# EAGLE design PowerReplayUSBC (EAGLE 9.6.2)
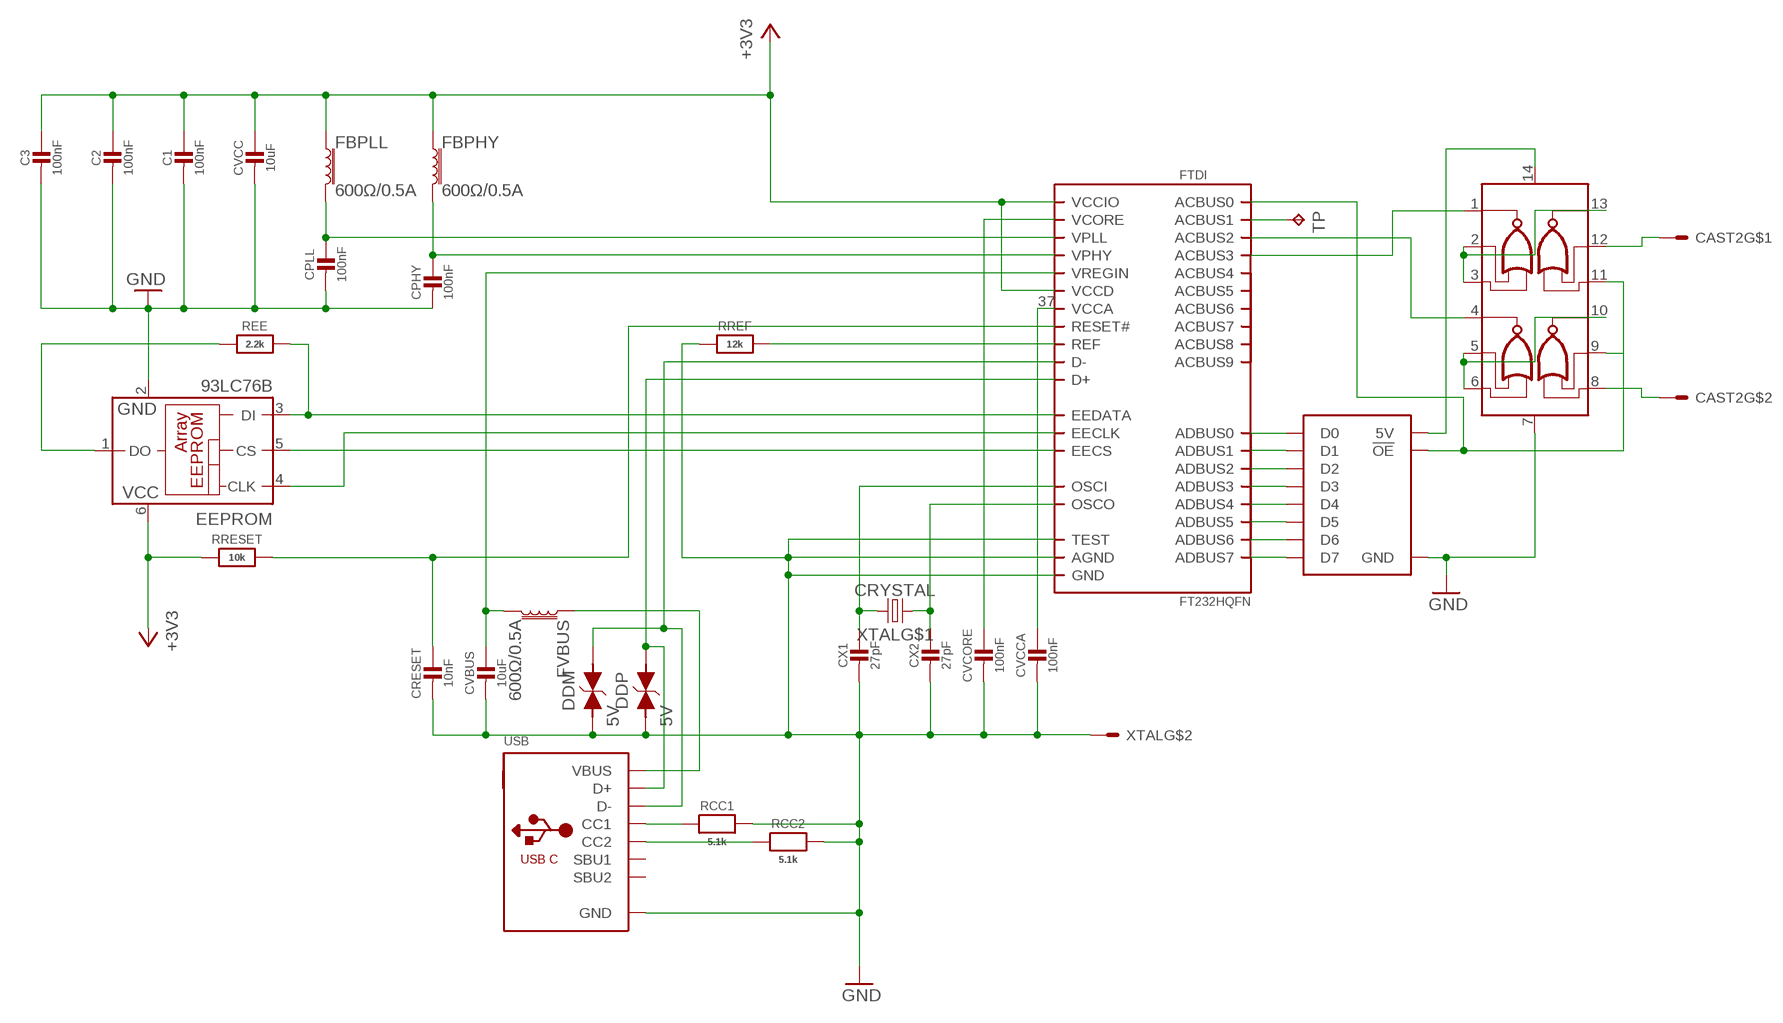
[diagram p0: schematic, sheet 1]

## Parts
C1  100nF  CAPACITOR0603  [0603]
C2  100nF  CAPACITOR0603  [0603]
C3  100nF  CAPACITOR0603  [0603]
CAST1  BUFFER-CASTELLATION  [BUFFER-CASTELLATION]
CAST2  PLA-CASTELLATION  [PLA-CASTELLATION]
CPHY  100nF  CAPACITOR0603  [0603]
CPLL  100nF  CAPACITOR0603  [0603]
CRESET  10nF  CAPACITOR0603  [0603]
CVBUS  10uF  CAPACITOR1206  [1206]
CVCC  10uF  CAPACITOR1206  [1206]
CVCCA  100nF  CAPACITOR0603  [0603]
CVCORE  100nF  CAPACITOR0603  [0603]
CX1  27pF  CAPACITOR0402  [0402]
CX2  27pF  CAPACITOR0402  [0402]
DDM  5V  WE-VE_0603_82356050050  [WE-VE_0603]
DDP  5V  WE-VE_0603_82356050050  [WE-VE_0603]
EEPROM  93LC76B  [SOT23-6]
FBPHY  600Ω/0.5A  FERRITE_BEAD-0603  [0603]
FBPLL  600Ω/0.5A  FERRITE_BEAD-0603  [0603]
FTDI  FT232HQFN  [QFN48_8MM]
FVBUS  600Ω/0.5A  FERRITE_BEAD-0603  [0603]
GATES  7402TSSOP14  [TSSOP14-RU]
RCC1  5.1k  RESISTOR0402  [0402]
RCC2  5.1k  RESISTOR0402  [0402]
REE  2.2k  RESISTOR0603  [0603]
RREF  12k  RESISTOR0603  [0603]
RRESET  10k  RESISTOR0603  [0603]
TP  TP  [TP]
USB  USB-C  [USB-C]
XTAL  CRYSTAL  [SMD3225-4P]

## Nets
5V: CAST1.P$11(5V) GATES.14
!RESET_FT: CRESET.1 FTDI.34(RESET#) RRESET.2
+3V3: C1.1 C2.1 C3.1 CVCC.1 EEPROM.6(VCC) FBPHY.1 FBPLL.1 FTDI.12(VCCIO) FTDI.24(VCCIO) FTDI.39(VCCD) FTDI.46(VCCIO) RRESET.1
A0: FTDI.25(ACBUS1) TP.P$1(TP)
CC1: RCC1.1 USB.A5(CC1)
CC2: RCC2.1 USB.B5(CC2)
D0: CAST1.P$1(D0) FTDI.13(ADBUS0)
D1: CAST1.P$2(D1) FTDI.14(ADBUS1)
D2: CAST1.P$3(D2) FTDI.15(ADBUS2)
D3: CAST1.P$4(D3) FTDI.16(ADBUS3)
D4: CAST1.P$5(D4) FTDI.17(ADBUS4)
D5: CAST1.P$6(D5) FTDI.18(ADBUS5)
D6: CAST1.P$7(D6) FTDI.19(ADBUS6)
D7: CAST1.P$8(D7) FTDI.20(ADBUS7)
DM: DDM.1 FTDI.6(D-) USB.A7(D-) USB.B7(D-)
DP: DDP.1 FTDI.7(D+) USB.A6(D+) USB.B6(D+)
EECLK: EEPROM.4(CLK) FTDI.44(EECLK)
EECS: EEPROM.5(CS) FTDI.45(EECS)
EEDATA: EEPROM.3(DI) FTDI.43(EEDATA) REE.2
EEDO: EEPROM.1(DO) REE.1
GND: C1.2 C2.2 C3.2 CAST1.P$9(GND) CPHY.2 CPLL.2 CRESET.2 CVBUS.2 CVCC.2 CVCCA.2 CVCORE.2 CX1.2 CX2.2 DDM.2 DDP.2 EEPROM.2(GND) FTDI.4(AGND) FTDI.9(AGND) FTDI.10(GND) FTDI.11(GND) FTDI.22(GND) FTDI.23(GND) FTDI.35(GND) FTDI.36(GND) FTDI.41(AGND) FTDI.42(TEST) FTDI.47(GND) FTDI.48(GND) FTDI.THERMAL(GND) GATES.7 RCC1.2 RCC2.2 RREF.1 USB.A1B12(GND) USB.B1A12(GND) USB.M1(GND) USB.M2(GND) USB.M3(GND) USB.M4(GND) XTAL.P$2(S) XTAL.P$4(S)
OE: CAST1.P$10(!OE) FTDI.21(ACBUS0) GATES.9 GATES.11
RD: CAST2.P$2 GATES.8
RD+CS: FTDI.26(ACBUS2) GATES.4
REF: FTDI.5(REF) RREF.2
RRD: GATES.5 GATES.6 GATES.10
RWR: GATES.2 GATES.3 GATES.13
VBUS: FVBUS.1 USB.A4B9(VBUS) USB.B4A9(VBUS)
VCCA: CVCCA.1 FTDI.37(VCCA)
VCORE: CVCORE.1 FTDI.38(VCORE)
VPHY: CPHY.1 FBPHY.2 FTDI.3(VPHY)
VPLL: CPLL.1 FBPLL.2 FTDI.8(VPLL)
VREGIN: CVBUS.1 FTDI.40(VREGIN) FVBUS.2
WR: CAST2.P$1 GATES.12
WR+CS: FTDI.27(ACBUS3) GATES.1
XI: CX1.1 FTDI.1(OSCI) XTAL.P$1(X1)
XO: CX2.1 FTDI.2(OSCO) XTAL.P$3(X2)
Unconnected: FTDI.28(ACBUS4) FTDI.29(ACBUS5) FTDI.30(ACBUS6) FTDI.31(ACBUS7) FTDI.32(ACBUS8) FTDI.33(ACBUS9) USB.A8(SBU1) USB.B8(SBU2)

## Library data of the parts
C1-C3 CPHY CPLL CRESET CVBUS CVCC CVCCA CVCORE CX1 CX2 = pixel:CAPACITOR
CAST1 = pixel:BUFFER-CASTELLATION
CAST2 = pixel:PLA-CASTELLATION
DDM DDP = Wurth_EMC Components_WE-VE:WE-VE_0603: WE-VE ESD Suppressor Characteristics Fast response time No leakage current Low clamping voltage Almost no energy consumption in stand-by mode Excellent absorption for ESD-impulses Operating temperature: –40 ºC to +85 ºC Nickel barrier Applications Protection of data lines Protection of bus systems Protection of semiconductors ESD protection in accordance with EN 61000-4-2: – 8 kV contact discharge – 15 kV air discharge <https://katalog.we-online.de/media/images/v2/o14891v209%20Family_WE-VE.jpg> Details see: https://katalog.we-online.de/en/pbs/WE-VE Updated by Ella Wu 2019-07-04 2019 (C) Wurth Elektronik; DATASHEET-URL: https://katalog.we-online.de/pbs/datasheet/82356050050.pdf; ILEAK: 1uA; MOUNT: SMT; PART-NUMBER: 82356050050; RISO: 10 MOhm; VCLAMP-TYP: 75V; VESD-AIR: 15kV
EEPROM = microchip:93*76?: 8K Microwire Compatible Serial EEPROM Source: http://ww1.microchip.com/downloads/en/DeviceDoc/21796H.pdf; MF: MICROCHIP; MPN: 93LC76BT-I/OT; OC_FARNELL: 1556170; OC_NEWARK: 61H6848
FBPHY FBPLL FVBUS = SparkFun-Coils:FERRITE_BEAD: Ferrite Bead (blocks, cores, rings, chokes, etc.) Inductor with layers of ferrite used to suppress high frequencies. Often used to isolate high frequency noise. SparkFun Products: IOIO-OTG - V2.2 <https://www.sparkfun.com/products/13613> SparkFun SAMD21 Mini Breakout <https://www.sparkfun.com/products/13664> SparkFun 6 Degrees of Freedom Breakout - LSM6DS3 <https://www.sparkfun.com/products/13339> SparkFun SAMD21 Dev Breakout <https://www.sparkfun.com/products/13672>; PROD_ID: NDUC-07859; VALUE: 30Ω/1.8A
FTDI = pixel:FT232H
GATES = pixel:7402
RCC1 RCC2 REE RREF RRESET = pixel:RESISTOR
TP = pixel:TP
USB = pixel:USB-C: USB Type-C USB 2.0 Connector
XTAL = pixel:CRYSTAL

## Board
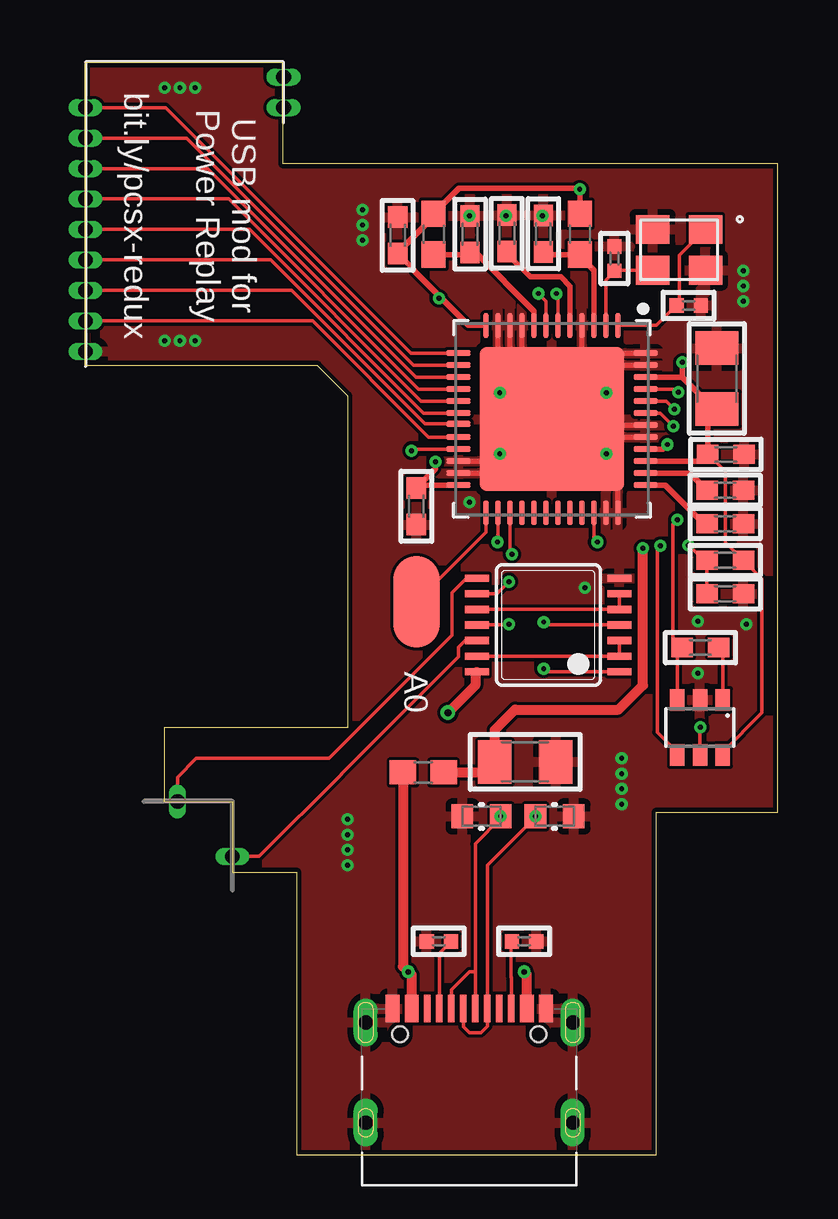
[diagram p1: board, top side]
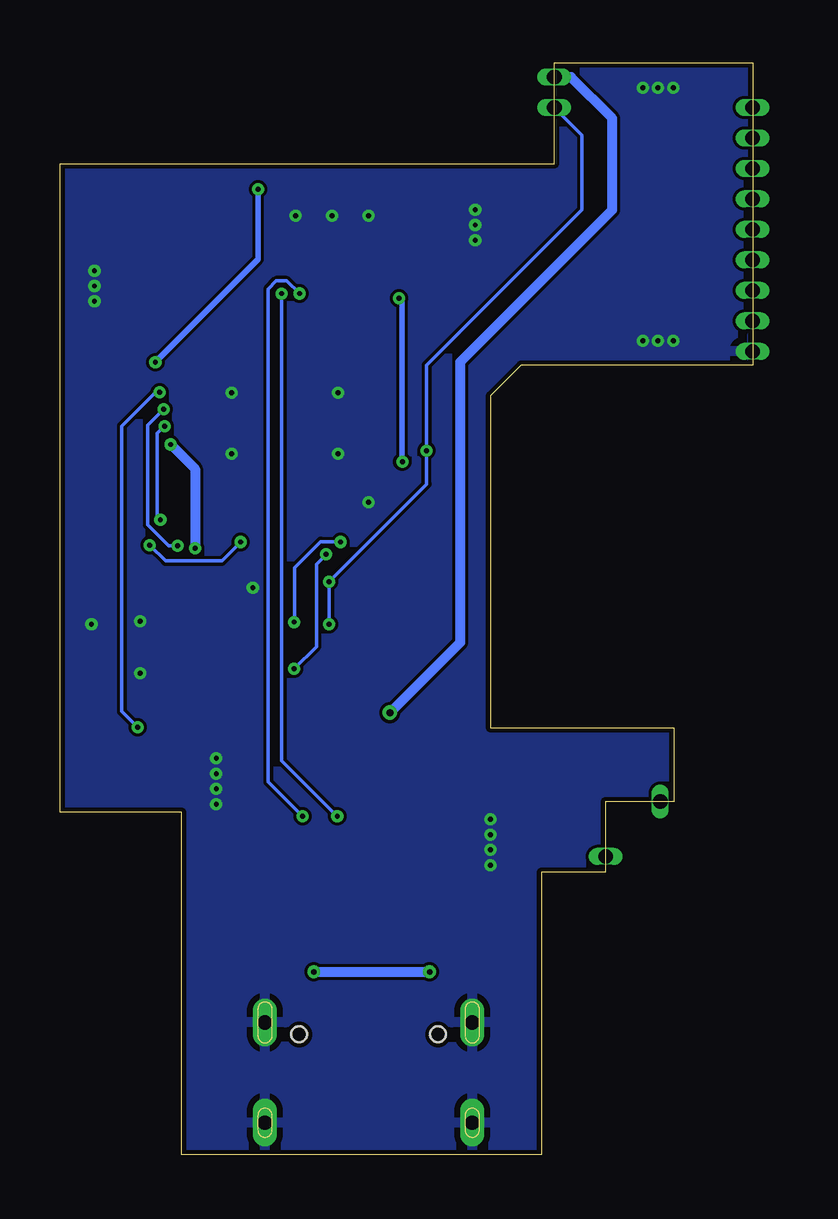
[diagram p2: board, bottom side, seen from below]

Size 28.88 x 45.49 mm. Coordinates in mm from the lower left corner, seen from the top.
Outline: 8.8,0 23.8,0 23.8,14.27 28.88,14.27 28.88,41.3 8.25,41.3 8.25,45.49 0,45.49 0,32.89 9.66,32.89 10.93,31.62 10.93,17.78 3.29,17.78 3.29,14.71 6.14,14.71 6.14,11.76 8.8,11.76 8.8,0
Copper layers (1*16): Top 0.035mm / dielectric 1.5mm / Bottom 0.035mm
Design rules "default *": minimum track width 5mil, minimum drill 0.2mm, track to track 5mil, track to pad 0.2mm, pad to pad 5mil, via to via 0.2mm, smd to smd 5mil, copper to edge 0.2mm, drill to drill 6mil, minimum pad ring 1mil, minimum via ring 0.15mm, stop-mask expansion 4mil, vias tented up to drill 25mil, thermal gap 10mil

### Footprints (pad centres in the part's own frame; a part is rotated, then mirrored left to right if it is on the bottom)
0603 = smd 0.9 x 0.8: 1 -0.762,0; 2 0.762,0
BUFFER-CASTELLATION = drill 0.61 pad 0.711 long: P$1 -4.445,-5.08; P$2 -3.175,-5.08; P$3 -1.905,-5.08; P$4 -0.635,-5.08; P$5 0.635,-5.08; P$6 1.905,-5.08; P$7 3.175,-5.08; P$8 4.445,-5.08; P$9 5.715,-5.08; P$10 -4.445,3.175; P$11 -5.715,3.175
PLA-CASTELLATION = drill 0.61 pad 0.711 long: P$1 2.286,0; P$2 0,2.286
1206 = smd 1.4 x 1.8: 1 -1.27,0; 2 1.27,0
0402 = smd 0.6 x 0.6: 1 -0.508,0; 2 0.508,0
WE-VE_0603 = smd 0.9 x 1: 1 -0.8,0; 2 0.8,0
SOT23-6 = smd 0.6 x 0.9: 1 -0.95,-1.15; 2 0,-1.15; 3 0.95,-1.15; 4 0.95,1.15; 5 0,1.15; 6 -0.95,1.15
0603' = smd 1.1 x 1: 1 -0.85,0; 2 0.85,0
QFN48_8MM = smd 1 x 0.23: 1 -3.9,2.75; 2 -3.9,2.25; 3 -3.9,1.75; 4 -3.9,1.25; 5 -3.9,0.75; 6 -3.9,0.25; 7 -3.9,-0.25; 8 -3.9,-0.75; 9 -3.9,-1.25; 10 -3.9,-1.75; 11 -3.9,-2.25; 12 -3.9,-2.75; 25 3.9,-2.75; 26 3.9,-2.25; 27 3.9,-1.75; 28 3.9,-1.25; 29 3.9,-0.75; 30 3.9,-0.25; 31 3.9,0.25; 32 3.9,0.75; 33 3.9,1.25; 34 3.9,1.75; 35 3.9,2.25; 36 3.9,2.75 | smd 0.23 x 1: 13 -2.75,-3.9; 14 -2.25,-3.9; 15 -1.75,-3.9; 16 -1.25,-3.9; 17 -0.75,-3.9; 18 -0.25,-3.9; 19 0.2,-3.9; 20 0.75,-3.9; 21 1.25,-3.9; 22 1.75,-3.9; 23 2.25,-3.9; 24 2.75,-3.9; 37 2.75,3.9; 38 2.25,3.9; 39 1.75,3.9; 40 1.25,3.9; 41 0.75,3.9; 42 0.25,3.9; 43 -0.25,3.9; 44 -0.75,3.9; 45 -1.25,3.9; 46 -1.75,3.9; 47 -2.25,3.9; 48 -2.75,3.9 | smd 6 x 6: THERMAL 0,0
TSSOP14-RU = smd 0.305 x 0.991: 1 -1.95,-2.968; 2 -1.3,-2.968; 3 -0.65,-2.968; 4 0,-2.968; 5 0.65,-2.968; 6 1.3,-2.968; 7 1.95,-2.968; 8 1.95,2.968; 9 1.3,2.968; 10 0.65,2.968; 11 0,2.968; 12 -0.65,2.968; 13 -1.3,2.968; 14 -1.95,2.968
TP = smd 3.81 x 1.93: P$1 0,0
USB-C = smd 0.575 x 1.15: A1B12 -3.2,3.545; A4B9 -2.4,3.545; B1A12 3.2,3.545; B4A9 2.4,3.545 | smd 0.275 x 1.15: A5 -1.25,3.545; A6 -0.25,3.545; A7 0.25,3.545; A8 1.25,3.545; B5 1.75,3.545; B6 0.75,3.545; B7 -0.75,3.545; B8 -1.75,3.545 | drill 0.6 pad 1 long: M1 -4.32,2.97; M2 4.32,2.97; M3 -4.32,-1.21; M4 4.32,-1.21 | hole 0.65: 2.89,2.47; -2.89,2.47
SMD3225-4P = smd 1.4 x 1.2: P$1 -1.1,-0.85; P$2 1.1,-0.85; P$3 1.1,0.85; P$4 -1.1,0.85

### Placement (x,y rotation side)
C1  13.02,38.31 90 top
C2  26.71,29.18 0 top
C3  13.8,27.02 270 top
CAST1  5.09,39.19 270 top
CAST2  3.85,12.43 0 top
CPHY  19.09,38.37 90 top
CPLL  16.04,38.35 90 top
CRESET  26.67,23.37 0 top
CVBUS  18.34,16.37 0 top
CVCC  26.32,32.34 90 top
CVCCA  26.67,26.29 0 top
CVCORE  26.67,27.69 0 top
CX1  25.15,35.39 0 top
CX2  22.05,37.34 90 top
DDM  16.51,14.1 180 top
DDP  19.56,14.1 0 top
EEPROM  25.62,17.8 180 top
FBPHY  600Ω/0.5A  [0603']  20.61,38.35 270 top
FBPLL  600Ω/0.5A  [0603']  14.51,38.35 270 top
FTDI  19.45,30.65 270 top
FVBUS  600Ω/0.5A  [0603']  14.09,15.92 0 top
GATES  19.29,22.07 90 top
RCC1  14.74,8.89 180 top
RCC2  18.29,8.89 0 top
REE  25.64,21.13 180 top
RREF  17.58,38.39 270 top
RRESET  26.67,24.77 180 top
TP  13.8,23.03 90 top
USB  16.01,2.54 0 top
XTAL  24.75,37.7 180 top

### Tracks (layer width: path | path; a pad name or v marks a point on that pad's centre or on a via)
5V  (via drill 0.3)
  Top 0.406: GATES.14 16.26,20.06 16.26,19.56 v15.12,18.41
  Bottom 0.406: v15.12,18.41 12.2,21.34 12.2,33.02 5.85,39.37 5.85,43.18 7.57,44.9 7.85,44.9 CAST1.P$11
!RESET_FT  (via drill 0.2)
  Top 0.152: CRESET.1 RRESET.2 25.79,24.77 25.15,25.4 v25.13,25.4 | v21.34,25.53 21.2,25.66 FTDI.34
  Bottom 0.152: v25.13,25.4 24.48,24.75 22.12,24.75 v21.34,25.53
+3V3  (via drill 0.2)
  Top 0.152: 25.94,29.21 26.67,28.48 26.67,25.53 RRESET.1 28.2,24 28.2,18.4 26.57,16.78 EEPROM.6
  Top 0.229: 24.9,32.4 26.23,31.07 CVCC.1 26.17,31.07 25.94,30.84 25.94,29.21 C2.1 25.67,28.9 FTDI.39 | FTDI.12 15.97,34.55 14.72,35.8 | 14.72,35.8 13.7,36.82 13.7,36.87 C1.1 13.02,37.59 14.51,39.08 FBPLL.1 15.57,40.26 20.57,40.26 v20.61,40.22 FBPHY.1 | FTDI.24 13.92,27.9 C3.1 14.6,28.58 v14.6,28.87 | 24.9,32.4 v24.9,33.02 | v14.74,35.69 14.72,35.7 14.72,35.8 | FTDI.46 24.9,32.4
  Bottom 0.229: v24.9,33.02 20.61,37.31 v20.61,40.22 | v14.6,28.87 14.61,28.88 14.61,35.69 v14.74,35.69
A0
  Top 0.152: TP.P$1 16.7,25.94 FTDI.25
CC1
  Top 0.152: USB.A5 14.76,8.4 RCC1.1
CC2
  Top 0.152: USB.B5 17.76,7.39 17.75,7.4 17.75,8.86 RCC2.1
D0
  Top 0.152: CAST1.P$1 3.35,43.63 13.58,33.4 FTDI.13
D1
  Top 0.152: CAST1.P$2 4.22,42.36 13.68,32.9 FTDI.14
D2
  Top 0.152: CAST1.P$3 5.1,41.09 13.79,32.4 FTDI.15
D3
  Top 0.152: CAST1.P$4 5.97,39.82 13.89,31.9 FTDI.16
D4
  Top 0.152: CAST1.P$5 6.85,38.55 14,31.4 FTDI.17
D5
  Top 0.152: CAST1.P$6 7.72,37.28 14.1,30.9 FTDI.18
D6
  Top 0.152: CAST1.P$7 8.6,36.01 14.16,30.45 FTDI.19
D7
  Top 0.152: FTDI.20 14.31,29.9 9.47,34.74 CAST1.P$8
DM  (via drill 0.2)
  Top 0.152: DDM.1 17.31,14.01 16.26,12.95 16.26,7.62 | FTDI.6 19.7,35.81 v19.64,35.88 | 16.26,7.62 USB.A7 | USB.B7 15.26,6.87 16.01,7.62 16.26,7.62
  Bottom 0.152: v19.64,35.88 19.64,16.42 DDM.1
  other vias: 17.31,14.1
DP  (via drill 0.2)
  Top 0.152: FTDI.7 19.2,35.57 v18.89,35.88 | DDP.1 18.76,14.06 16.76,12.05 USB.B6 16.76,5.35 16.49,5.08 16.39,5.08 16.01,5.08 15.76,5.33 USB.A6
  Bottom 0.152: v18.89,35.88 19.42,36.41 19.86,36.41 20.2,36.07 20.2,15.53 DDP.1
  other vias: 18.76,14.1
EECLK  (via drill 0.2)
  Top 0.152: FTDI.44 24.21,31.4 v24.56,31.06 | v23.97,25.38 23.84,25.25 23.84,17.61 24.67,16.78 EEPROM.4
  Bottom 0.152: v24.56,31.06 25.21,30.4 25.21,26.24 24.35,25.38 v23.97,25.38
EECS  (via drill 0.2)
  Top 0.152: FTDI.45 24.58,31.9 v24.72,31.76 | v25.63,17.8 25.62,17.79 EEPROM.5
  Bottom 0.152: v24.72,31.76 24.88,31.76 26.29,30.35 26.29,18.47 v25.63,17.8
EEDATA  (via drill 0.2)
  Top 0.152: EEPROM.3 24.67,20.92 REE.2 24.5,21.51 24.5,26.27 v24.69,26.46 | v24.52,30.35 23.97,30.9 FTDI.43
  Bottom 0.152: v24.52,30.35 24.81,30.05 24.81,26.59 v24.69,26.46
EEDO
  Top 0.152: EEPROM.1 26.57,20.96 REE.1
GND  (via drill 0.2)
  Top 0.152: CPHY.2 19.08,39.12 v19.05,39.12 | RREF.1 17.54,39.12 v17.53,39.12
  Top 0.229: FTDI.42 19.7,30.4 17.2,32.9 FTDI.11 | FTDI.22 17.28,28.9 16.78,28.4 FTDI.23 | FTDI.48 22.37,33.4 20.7,31.73 20.7,33.02 | FTDI.4 20.7,33.02 | FTDI.10 17.7,32.18 | FTDI.36 22.2,28.09 19.82,30.48 19.45,30.48 | FTDI.41 19.67,29.9 19.45,30.12 | FTDI.47 20.82,32.9 20.7,33.02 | FTDI.9 18.2,33.36 19.63,31.93 19.63,30.66
  Top 0.406: 19.7,30.4 FTDI.THERMAL 19.45,30.48 | 17.28,28.9 18.24,28.9 19.45,30.12 19.45,30.48 | 20.7,31.73 19.63,30.66 | 19.63,30.66 19.45,30.48 | 17.7,32.18 v17.28,31.75 18.36,30.66 19.63,30.66
  other vias: 22.36,16.51 22.36,15.88 22.36,15.24 22.36,14.61 25.53,20.07 27.56,22.1 20.83,23.62 16.01,27.18 3.31,44.45 3.94,44.45 4.58,44.45 3.31,33.91 3.94,33.91 4.58,33.91 16.01,39.12 11.56,38.74 11.56,38.1 11.56,39.37 27.44,36.83 27.44,35.56 25.53,22.22 17.28,29.21 21.72,29.21 21.72,31.75 10.93,13.97 10.93,13.33 10.93,12.7 10.93,12.06 27.44,36.2
  pour Top: -0.25,45.72 8.39,45.72 8.39,41.53 29.21,41.53 29.21,13.97 24.01,13.97 24.01,0 8.64,0 8.64,11.68 6.1,11.68 6.1,14.73 3.18,14.73 3.18,18.03 10.67,18.03 10.67,31.62 9.53,32.77 -0.25,32.77
  pour Bottom: 9.53,32.77 10.67,31.62 10.67,18.03 3.18,18.03 3.18,14.73 6.1,14.73 6.1,11.68 8.64,11.68 8.64,0 24.01,0 24.01,13.97 29.21,13.97 29.21,41.53 8.39,41.53 8.39,45.72 -0.25,45.72 -0.25,32.77
OE  (via drill 0.2)
  Top 0.152: v13.59,29.34 13.66,29.4 FTDI.21 | v17.66,23.88 17.15,23.37 GATES.9 | v17.66,22.1 17.63,22.07 GATES.11
  Bottom 0.152: v17.66,22.1 v17.66,23.88 13.59,27.94 v13.59,29.34 13.59,32.89 7.12,39.37 7.12,42.48 CAST1.P$10
RD
  Top 0.152: GATES.8 15.9,24.02 15.29,23.41 15.29,21.64 10.16,16.51 4.62,16.51 3.85,15.73 CAST2.P$2
RD+CS  (via drill 0.2)
  Top 0.152: GATES.4 19.23,22.07 v19.11,22.19 | v17.18,25.53 17.2,25.55 FTDI.26
  Bottom 0.152: v19.11,22.19 19.1,22.2 19.1,24.45 18,25.55 17.2,25.55 v17.18,25.53
REF
  Top 0.229: FTDI.5 20.2,36.19 19.82,36.58 18.55,36.58 17.58,37.55 RREF.2
RRD
  Top 0.152: GATES.10 GATES.5 GATES.6
RWR
  Top 0.152: GATES.13 GATES.2 GATES.3
VBUS  (via drill 0.23)
  Top 0.406: USB.A4B9 13.61,7.48 v13.47,7.62 13.24,7.85 FVBUS.1 | USB.B4A9 18.41,7.51 v18.29,7.62
  Bottom 0.406: v18.29,7.62 v13.47,7.62
VCCA
  Top 0.229: FTDI.37 24.17,27.9 25.79,26.29 CVCCA.1
VCORE
  Top 0.229: FTDI.38 25.2,28.4 CVCORE.1
VPHY
  Top 0.229: FTDI.3 21.2,36.84 20.61,37.43 FBPHY.2 19.2,37.5 CPHY.1
VPLL
  Top 0.229: FTDI.8 18.7,35.15 16.26,37.59 CPLL.1 15.95,37.5 FBPLL.2
VREGIN  (via drill 0.2)
  Top 0.229: FTDI.40 24.07,29.4 v24.26,29.59
  Top 0.406: FVBUS.2 16.63,15.92 CVBUS.1 17.07,17.7 17.91,18.54 22.23,18.54 23.25,19.56 v23.25,25.27
  Bottom 0.406: v24.26,29.59 23.25,28.57 v23.25,25.27
WR
  Top 0.152: CAST2.P$1 7.24,12.43 10.67,15.86 10.67,15.88 15.55,20.75 15.55,21.14 15.84,21.42 GATES.12
WR+CS  (via drill 0.2)
  Top 0.152: GATES.1 19.23,20.12 v19.11,20.24 | v17.78,25.02 17.7,25.1 FTDI.27
  Bottom 0.152: v17.78,25.02 17.78,25 18.19,24.6 18.19,21.17 v19.11,20.24
XI
  Top 0.152: FTDI.1 23.81,34.55 CX1.1 24.77,35.51 24.77,37.47 XTAL.P$1
XO
  Top 0.152: XTAL.P$3 22.07,36.85 CX2.1 22.05,36.78 21.7,36.43 FTDI.2

### Text on the board
tNames: USB mod for / Power Replay / / bit.ly/pcsx-redux | A0